# Altium schematic sheet Antenna matching circuit.SchDoc: SIM868 Development Board
size 100 x 119 mm; SheetNumber: 5; SheetTotal: 14
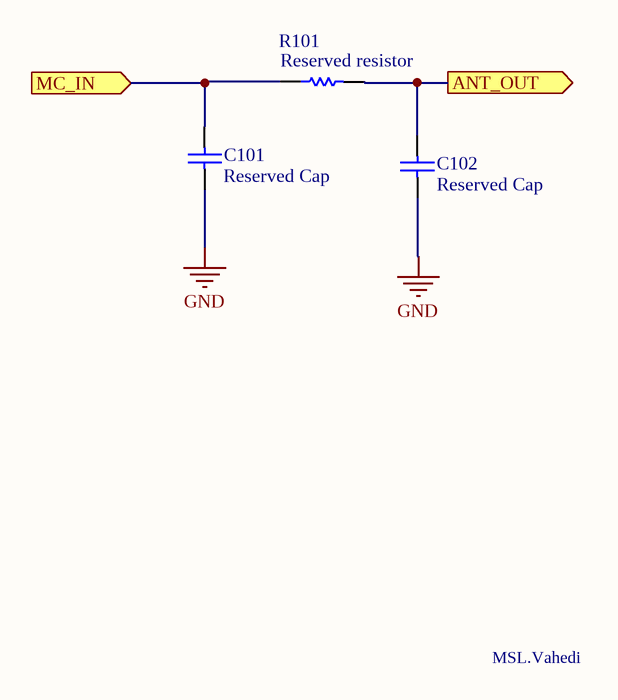
[diagram p0: Antenna matching circuit.SchDoc]

## Parts
C101  Reserved Cap  [CAP0805]
C102  Reserved Cap  [CAP0805]
R101  Reserved resistor  [RES0805]

## Ports
ANT_OUT (out), MC_IN (in)

## Nets
GND: C101.1 C102.1
ANT_OUT: C102.2 R101.2 ; port ANT_OUT
MC_IN: C101.2 R101.1 ; port MC_IN

## Notes on the sheet
- MSL.Vahedi

## Library data of the parts
C101 C102 = Cap: Capacitor; Published: 8-Jun-2000; LatestRevisionDate: 17-Jul-2002; LatestRevisionNote: Re-released for DXP Platform.; PackageReference: RAD-0.3; Publisher: Altium Limited; PackageDescription: Radial Cap, Thru-Hole; 2 Leads; 0.3 in Pin Spacing
R101 = Res1: Resistor; Published: 8-Jun-2000; LatestRevisionDate: 17-Jul-2002; LatestRevisionNote: Re-released for DXP Platform.; PackageReference: AXIAL-0.3; Publisher: Altium Limited; PackageDescription: Axial Device, Thru-Hole; 2 Leads; 0.3 in Pin Spacing